# EAGLE design Main (EAGLE 7.3.0)
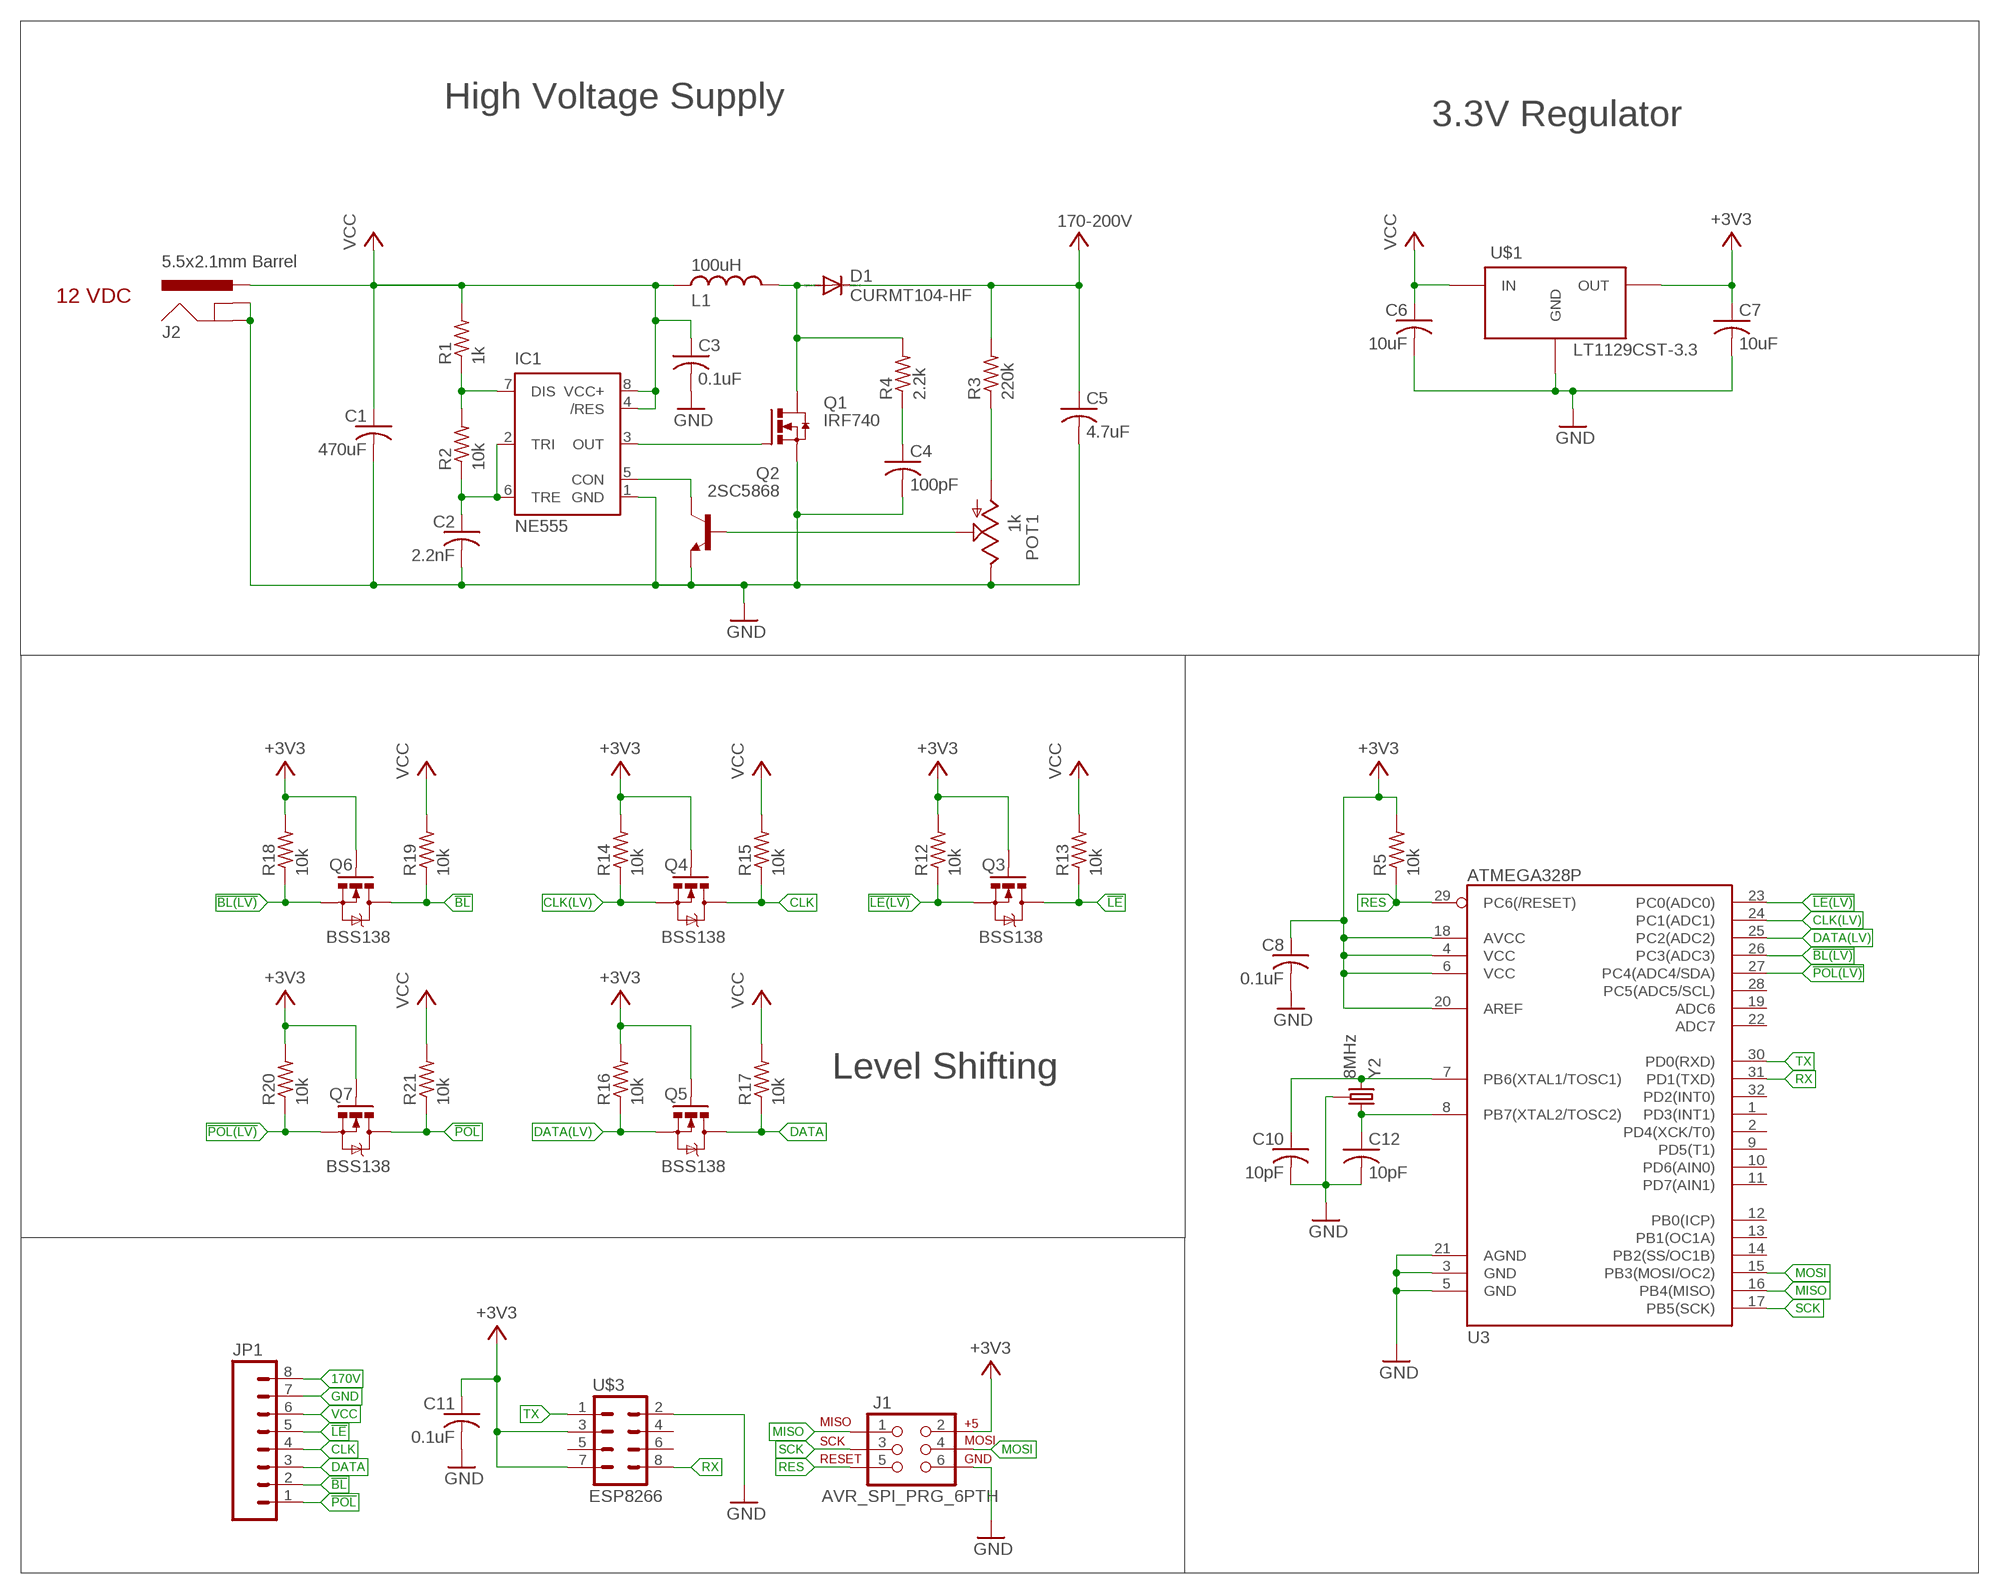
[diagram p0: schematic, sheet 1]

## Parts
C1  470uF  C-USC0603  [C0603]
C2  2.2nF  C-USC0603  [C0603]
C3  0.1uF  C-USC0603  [C0603]
C4  100pF  C-USC0603  [C0603]
C5  4.7uF  C-USC0603  [C0603]
C6  10uF  C-USC0603  [C0603]
C7  10uF  C-USC0603  [C0603]
C8  0.1uF  C-USC0603  [C0603]
C10  10pF  C-USC0603  [C0603]
C11  0.1uF  C-USC0603  [C0603]
C12  10pF  C-USC0603  [C0603]
D1  CURMT104-HF  CGRM4001-G  [SOD-123_MINI-SMA]
IC1  NE555  NE555D  [SO08]
J1  AVR_SPI_PRG_6PTH  [2X3]
J2  5.5x2.1mm Barrel  POWER_JACKSMD  [POWER_JACK_SMD]
JP1  M08  [1X08_PIN1_NO_SILK]
L1  100uH  L-USL2012C  [L2012C]
POT1  1k  TRIM_US-DIL3  [1X03]
Q1  IRF740  IRF3704S  [D2PACK]
Q2  2SC5868  BC850SMD  [SOT23-BEC]
Q3  BSS138  MOSFET-NCHANNELBSS138  [SOT23]
Q4  BSS138  MOSFET-NCHANNELBSS138  [SOT23]
Q5  BSS138  MOSFET-NCHANNELBSS138  [SOT23]
Q6  BSS138  MOSFET-NCHANNELBSS138  [SOT23]
Q7  BSS138  MOSFET-NCHANNELBSS138  [SOT23]
R1  1k  R-US_R0603  [R0603]
R2  10k  R-US_R0603  [R0603]
R3  220k  R-US_R0603  [R0603]
R4  2.2k  R-US_R0603  [R0603]
R5  10k  R-US_R0603  [R0603]
R12  10k  R-US_R0603  [R0603]
R13  10k  R-US_R0603  [R0603]
R14  10k  R-US_R0603  [R0603]
R15  10k  R-US_R0603  [R0603]
R16  10k  R-US_R0603  [R0603]
R17  10k  R-US_R0603  [R0603]
R18  10k  R-US_R0603  [R0603]
R19  10k  R-US_R0603  [R0603]
R20  10k  R-US_R0603  [R0603]
R21  10k  R-US_R0603  [R0603]
U3  ATMEGA328P  ATMEGA328_SMT  [TQFP32-08]
U$1  LT1129CST-3.3  [SOT-223]
U$3  ESP8266  M04X2  [2X4]
Y2  8MHz  CRYSTALCTS406  [CTS406]

## Nets
170V: C5.1 D1.C JP1.8 R3.2 ; supply symbol labelled 170-200V
!BL: JP1.2 Q6.3(D) R19.1
!BL(LV): Q6.2(S) R18.1 U3.26(PC3(ADC3))
!LE: JP1.5 Q3.3(D) R13.1
!LE(LV): Q3.2(S) R12.1 U3.23(PC0(ADC0))
!POL: JP1.1 Q7.3(D) R21.1
!POL(LV): Q7.2(S) R20.1 U3.27(PC4(ADC4/SDA))
+3V3: C7.1 C8.1 C11.1 J1.2 Q3.1(G) Q4.1(G) Q5.1(G) Q6.1(G) Q7.1(G) R5.2 R12.2 R14.2 R16.2 R18.2 R20.2 U3.4(VCC) U3.6(VCC) U3.18(AVCC) U3.20(AREF) U$1.VOUT(OUT) U$3.3 U$3.7
CLK: JP1.4 Q4.3(D) R15.1
CLK(LV): Q4.2(S) R14.1 U3.24(PC1(ADC1))
DATA: JP1.3 Q5.3(D) R17.1
DATA(LV): Q5.2(S) R16.1 U3.25(PC2(ADC2))
GND: C1.2 C2.2 C3.2 C4.2 C5.2 C6.2 C7.2 C8.2 C10.2 C11.2 C12.2 IC1.1(GND) J1.6 J2.GND(GNDBREAK) J2.P$4(GND) JP1.7 POT1.3(E) Q1.3(S) Q2.E U3.3(GND) U3.5(GND) U3.21(AGND) U$1.GND U$1.GND1(GND) U$3.2 Y2.2(GND) Y2.4(GND)
MISO: J1.1 U3.16(PB4(MISO))
MOSI: J1.4 U3.15(PB3(MOSI/OC2))
N$1: C2.1 IC1.2(TRI) IC1.6(TRE) R2.1
N$2: C12.1 U3.8(PB7(XTAL2/TOSC2)) Y2.1
N$3: IC1.7(DIS) R1.1 R2.2
N$4: C10.1 U3.7(PB6(XTAL1/TOSC1)) Y2.3
N$5: IC1.3(OUT) Q1.1(G)
N$6: D1.A L1.1 Q1.2(D) R4.2
N$9: C4.1 R4.1
N$12: POT1.1(A) R3.1
N$13: IC1.5(CON) Q2.C
POT1: POT1.2(S) Q2.B
RES: J1.5 R5.1 U3.29(PC6(/RESET))
RX: U3.31(PD1(TXD)) U$3.8
SCK: J1.3 U3.17(PB5(SCK))
TX: U3.30(PD0(RXD)) U$3.1
VCC: C1.1 C3.1 C6.1 IC1.4(/RES) IC1.8(VCC+) J2.VIN0(PWR) JP1.6 L1.2 R1.2 R13.2 R15.2 R17.2 R19.2 R21.2 U$1.VIN(IN)
Unconnected: U3.1(PD3(INT1)) U3.2(PD4(XCK/T0)) U3.9(PD5(T1)) U3.10(PD6(AIN0)) U3.11(PD7(AIN1)) U3.12(PB0(ICP)) U3.13(PB1(OC1A)) U3.14(PB2(SS/OC1B)) U3.19(ADC6) U3.22(ADC7) U3.28(PC5(ADC5/SCL)) U3.32(PD2(INT0)) U$3.4 U$3.5 U$3.6

## Notes on the sheet
- High Voltage Supply
- 3.3V Regulator
- 12 VDC
- Level Shifting

## Library data of the parts
C1-C8 C10-C12 = resistor:C-US: CAPACITOR, American symbol
D1 = diode:CGRM400*-G: Molded plasitc,JEDEC SOD-123/Mini SMA Source: Comchip CGRM4001-G.pdf
IC1 = SparkFun-AnalogIC:NE555: General purpose bipolar Timer
J1 = SparkFun-Connectors:AVR_SPI_PRG_6: AVR ISP 6 Pin This is the reduced ISP connector for AVR programming. Common on Arduino. This footprint will take up less PCB space and can be used with a 10-pin to 6-pin adapter such as SKU: BOB-08508 **Special note about "TEST_POINT" package. The stop mask is on the top side, so if you want your programming test points to be on the bottom of your board, make sure to place this package on the bottom side of the board. This also ensure that the orientation to program from the bottom side will be correct.
J2 = SparkFun-Connectors:POWER_JACK: Power Jack This is the standard 5.5mm barrel jack for power. The PTH is the most common, proven, reliable, footprint. The Slot footprint only works if the mill layer is transmitted to the PCB fab house so be warned. Mating wall wart : TOL-00298 (and others); PROD_ID: CONN-08106
JP1 = SparkFun-Connectors:M08: Header 8 Standard 8-pin 0.1" header. Use with straight break away headers (SKU : PRT-00116), right angle break away headers (PRT-00553), swiss pins (PRT-00743), machine pins (PRT-00117), and female headers (PRT-00115).
L1 = resistor:L-US: INDUCTOR, American symbol
POT1 = pot:TRIM_US-: POTENTIOMETER
Q1 = transistor-power:IRF3704: SMPS MOSFET HEXFET® Power MOSFET Source: http://www.irf.com/product-info/datasheets/data/irf3704.pdf
Q2 = transistor-npn:BC850*: NPN Transistor
Q3-Q7 = SparkFun-DiscreteSemi:MOSFET-NCHANNEL: Common NMOSFET Parts MFG P/N Store ID Prod ID FDD8780 TRANS-09984 SI7820DN TRANS-11055 FDS6630A IC-08089 2N7002PW TRANS-11151 FQP30N06L COM-10213 TRANS-10060 BSS123LT1G TRANS-08345 BSS138 TRANS-00830 BS170 2N7000; PROD_ID: TRANS-00830
R1-R5 R12-R21 = resistor:R-US_: RESISTOR, American symbol
U3 = SparkFun-DigitalIC:ATMEGA328_SMT: 32-Pin Atmega328 part Commonly used on Arduino compatible boards Available in QFP and QFN packages TQFP is IC-09069 QFN is non-stock; PROD_ID: IC-09069
U$1 = Alex:LT1129CST-3.3
U$3 = SparkFun-Connectors:M04X2: .1" header, two rows of four.
Y2 = crystal:CRYSTAL: CRYSTAL; OC_FARNELL: unknown; OC_NEWARK: unknown

## Board
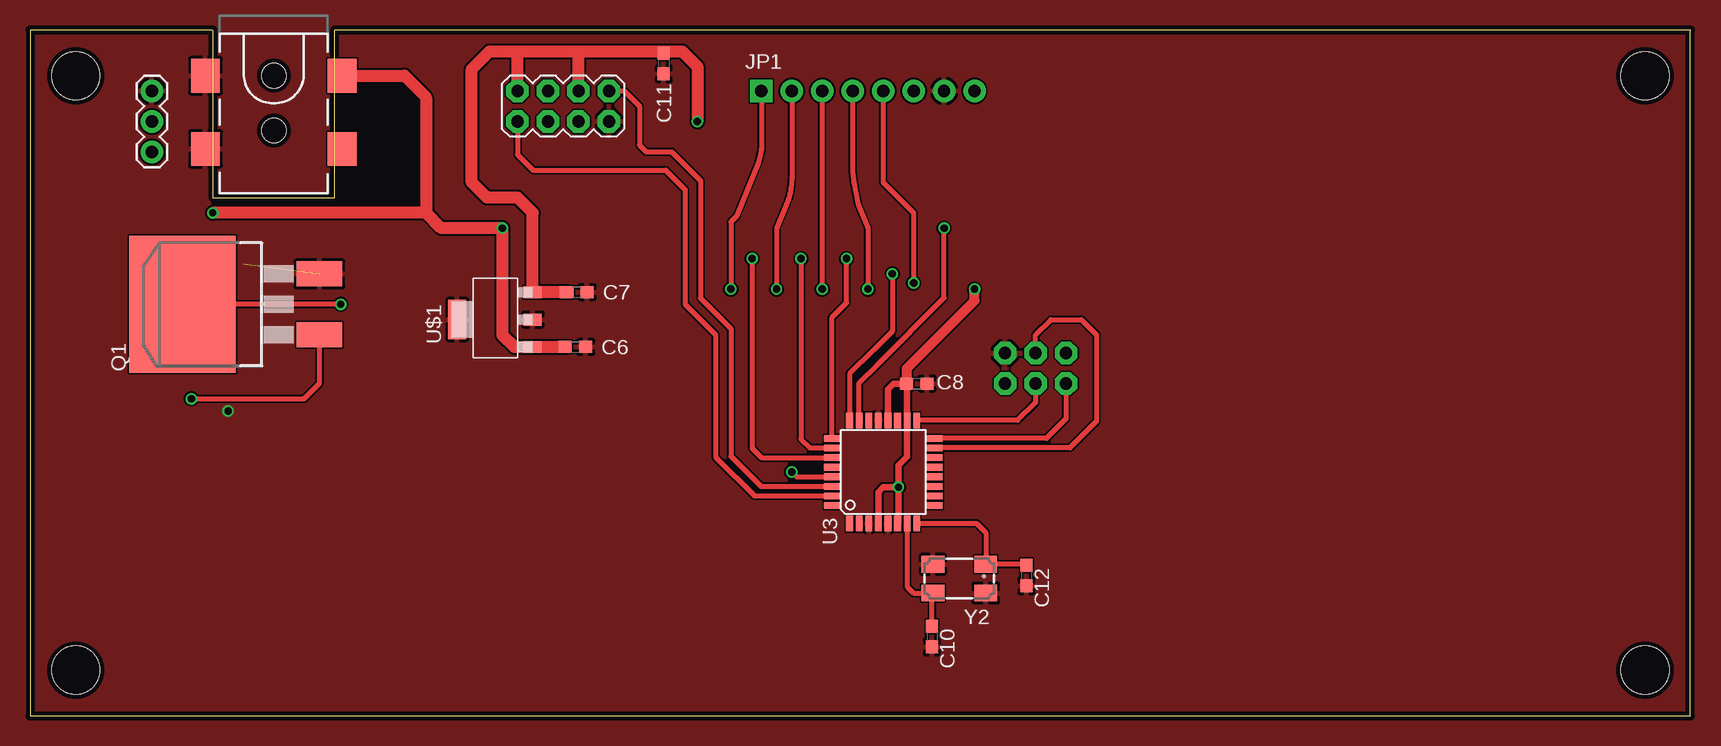
[diagram p1: board, top side]
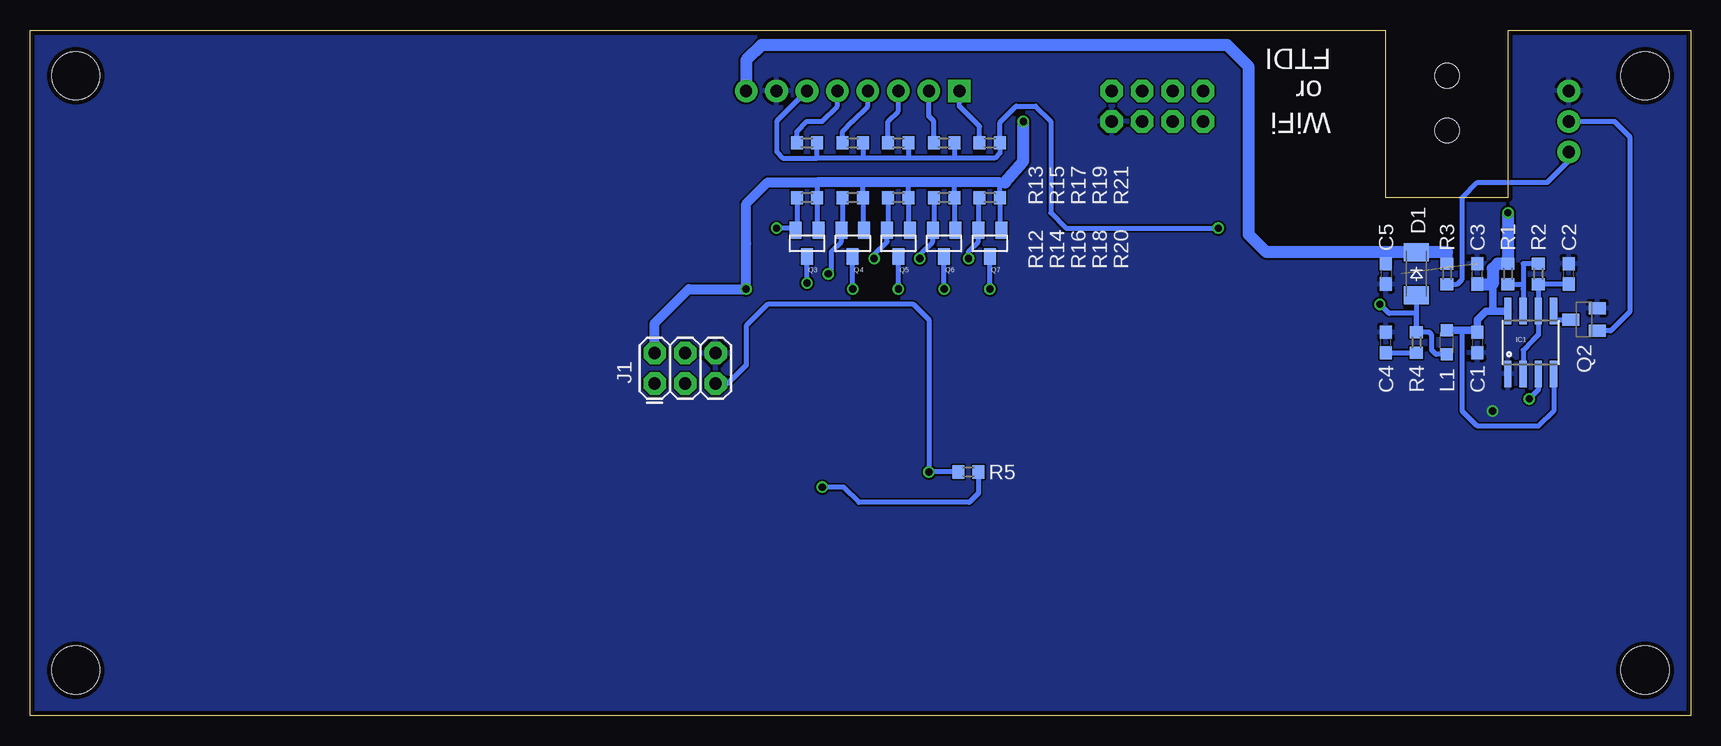
[diagram p2: board, bottom side, seen from below]

Size 138.43 x 57.15 mm. Coordinates in mm from the lower left corner, seen from the top.
Outline: 138.41,57.15 138.41,0 0,0 0,57.15 15.24,57.15 15.24,43.18 25.4,43.18 25.4,57.15 138.41,57.15
Outline: 138.41,57.15 138.43,57.15
Copper layers (1*16): Top 0.0356mm / dielectric 1.5011mm / Bottom 0.0356mm
Design rules "OSHpark": minimum track width 6mil, minimum drill 13mil, track to track 6mil, track to pad 6mil, pad to pad 6mil, via to via 6mil, smd to smd 6mil, copper to edge 15mil, drill to drill 6mil, minimum pad ring 7mil, minimum via ring 7mil, stop-mask expansion 3mil, vias tented up to drill 0mil, thermal gap 10mil
Holes 4 mm at 3.81,53.34 134.62,53.34 134.62,3.81 3.81,3.81

### Footprints (pad centres in the part's own frame; a part is rotated, then mirrored left to right if it is on the bottom)
C0603 = smd 1.1 x 1: 1 -0.85,0; 2 0.85,0
SOD-123_MINI-SMA = smd 1.5 x 2.1: A 1.8,0; C -1.8,0
SO08 = smd 0.61 x 2.21: 1 -1.905,-2.616; 2 -0.635,-2.616; 3 0.635,-2.616; 4 1.905,-2.616; 5 1.905,2.616; 6 0.635,2.616; 7 -0.635,2.616; 8 -1.905,2.616
2X3 = drill 1.016 pad 1.88 octagon: 1 0,0; 2 0,2.54; 3 2.54,0; 4 2.54,2.54; 5 5.08,0; 6 5.08,2.54
POWER_JACK_SMD = smd 2.8 x 2.4: GND 0,-5.7; P$4 6.1,-5.7; VIN0 0,5.7; VIN1 6.1,5.7 | hole 2.032: 0,0; 4.572,0
1X08_PIN1_NO_SILK = drill 1.016 pad 1.88 square: 1 0,0 | drill 1.016 pad 1.88: 2 2.54,0; 3 5.08,0; 4 7.62,0; 5 10.16,0; 6 12.7,0; 7 15.24,0; 8 17.78,0
L2012C = smd 1 x 1: 1 -1,0; 2 1,0
1X03 = drill 1.016 pad 1.88: 1 -2.54,0; 2 0,0; 3 2.54,0
D2PACK = smd 2.083 x 3.81: 1 -2.54,-8.89; 3 2.54,-8.89 | smd 11.43 x 8.89: 2 0,2.54
SOT23-BEC = smd 1 x 1.4: B -0.95,-1.1; C 0,1.1; E 0.95,-1.1
SOT23 = smd 1 x 1.4: 1 -0.95,-1.1; 2 0.95,-1.1; 3 0,1.1
R0603 = smd 1 x 1.1: 1 -0.85,0; 2 0.85,0
TQFP32-08 = smd 1.27 x 0.559: 1 -4.293,2.8; 2 -4.293,2; 3 -4.293,1.2; 4 -4.293,0.4; 5 -4.293,-0.4; 6 -4.293,-1.2; 7 -4.293,-2; 8 -4.293,-2.8; 17 4.293,-2.8; 18 4.293,-2; 19 4.293,-1.2; 20 4.293,-0.4; 21 4.293,0.4; 22 4.293,1.2; 23 4.293,2; 24 4.293,2.8 | smd 0.559 x 1.27: 9 -2.8,-4.293; 10 -2,-4.293; 11 -1.2,-4.293; 12 -0.4,-4.293; 13 0.4,-4.293; 14 1.2,-4.293; 15 2,-4.293; 16 2.8,-4.293; 25 2.8,4.293; 26 2,4.293; 27 1.2,4.293; 28 0.4,4.293; 29 -0.4,4.293; 30 -1.2,4.293; 31 -2,4.293; 32 -2.8,4.293
SOT-223 = smd 0.991 x 1.499: GND 0,-2.54; VIN -2.286,-2.54; VOUT 2.286,-2.54 | smd 3.277 x 1.499: GND1 0,3.759
2X4 = drill 1.016 pad 1.88 octagon: 1 -3.81,-1.27; 2 -3.81,1.27; 3 -1.27,-1.27; 4 -1.27,1.27; 5 1.27,-1.27; 6 1.27,1.27; 7 3.81,-1.27; 8 3.81,1.27
CTS406 = smd 1.9 x 1.4: 1 -2.2,-1.2; 2 2.2,-1.2; 3 2.2,1.2; 4 -2.2,1.2

### Placement (x,y rotation side)
C1  17.78,31.11 270 bottom
C2  10.16,36.83 90 bottom
C3  17.78,36.83 90 bottom
C4  25.4,31.11 90 bottom
C5  25.4,36.83 270 bottom
C6  45.47,30.73 0 top
C7  45.59,35.31 0 top
C8  73.91,27.69 0 top
C10  75.18,6.6 270 top
C11  52.83,54.36 270 top
C12  83.06,11.68 270 top
D1  22.86,36.83 270 bottom
IC1  13.34,31.11 0 bottom
J1  86.36,27.69 0 bottom
J2  20.32,53.34 270 top
JP1  60.96,52.07 0 top
L1  20.32,31.11 90 bottom
POT1  10.16,49.53 90 top
Q1  15.24,34.29 90 top
Q2  8.89,33.02 90 bottom
Q3  73.66,39.37 180 bottom
Q4  69.85,39.37 180 bottom
Q5  66.04,39.37 180 bottom
Q6  62.23,39.37 180 bottom
Q7  58.42,39.37 180 bottom
R1  15.24,36.83 90 bottom
R2  12.7,36.83 90 bottom
R3  20.32,36.83 90 bottom
R4  22.86,31.11 90 bottom
R5  60.2,20.32 0 bottom
R12  73.66,43.18 0 bottom
R13  73.66,47.75 0 bottom
R14  69.85,43.18 0 bottom
R15  69.85,47.75 0 bottom
R16  66.04,43.18 0 bottom
R17  66.04,47.75 0 bottom
R18  62.23,43.18 0 bottom
R19  62.23,47.75 0 bottom
R20  58.42,43.18 0 bottom
R21  58.42,47.75 0 bottom
U3  71.12,20.32 90 top
U$1  39.37,33.02 90 top
U$3  44.45,50.8 180 top
Y2  77.47,11.43 180 top

### Tracks (layer width: path | path; a pad name or v marks a point on that pad's centre or on a via)
170V
  Bottom 1.016: R3.2 20.32,38.63 D1.C 25.4,38.63 | 25.4,38.63 C5.1 | 25.4,38.63 35.36,38.63 36.83,40.1 36.83,54.08 38.63,55.88 77.47,55.88 78.74,54.61 JP1.8
!BL  (via drill 0.6)
  Top 0.406: JP1.2 63.5,44.87 arc-22 63.06,42.64 62.23,40.64 v62.23,35.56
  Bottom 0.406: v62.23,35.56 Q6.3 | R19.1 63.08,49.53 63.5,49.95 JP1.2
!BL(LV)  (via drill 0.6)
  Top 0.406: v64.26,38.1 64.26,23.06 65,22.32 U3.26
  Bottom 0.406: R18.1 63.08,40.47 Q6.2 63.18,39.52 64.26,38.44 v64.26,38.1
!LE  (via drill 0.6)
  Top 0.406: JP1.5 71.12,44.45 73.66,41.91 v73.66,36.07
  Bottom 0.406: v73.66,36.07 Q3.3 | 74.51,47.65 R13.1 74.51,48.68 73.66,49.53 72.39,49.53 71.12,50.8 JP1.5
!LE(LV)  (via drill 0.6)
  Top 0.406: U3.23 69.12,27.75 70.58,29.21 76.2,34.83 v76.2,40.64
  Bottom 0.406: R12.1 74.51,40.47 Q3.2 74.61,40.64 v76.2,40.64
!POL  (via drill 0.6)
  Top 0.406: JP1.1 60.96,47.22 60.74,46.11 58.88,41.63 58.42,41.17 v58.42,35.56
  Bottom 0.406: v58.42,35.56 Q7.3 | R21.1 59.27,49.11 59.69,49.53 60.96,50.8 JP1.1
!POL(LV)  (via drill 0.6)
  Top 0.406: v60.2,38.1 60.2,22.29 60.96,21.52 U3.27
  Bottom 0.406: R20.1 59.37,43.18 Q7.2 59.37,39.52 60.2,38.7 v60.2,38.1
+3V3  (via drill 0.6)
  Top 0.55: U3.20 71.52,27.21 71.99,27.69 C8.1 73.12,27.69 U3.18 73.12,21.59 72.39,20.86 v72.39,19.05 | U3.4 70.72,18.65 71.12,19.05 v72.39,19.05 | U3.6 72.39,16.03 v72.39,19.05
  Top 0.813: C8.1 73.06,28.92 78.74,34.6 v78.74,35.56
  Top 1.016: U$3.3 45.72,55.37 | 45.72,55.37 52.83,55.37 | 52.83,55.37 54.36,55.37 55.63,54.1 v55.63,49.53 | C7.1 U$1.VOUT 41.91,41.91 40.64,43.18 38.1,43.18 36.83,44.45 36.83,53.89 38.31,55.37 40.64,55.37 | 40.64,55.37 45.72,55.37 | U$3.7 40.64,55.37 | C11.1 52.83,55.37
  Bottom 0.406: Q3.1 72.81,40.47 R12.2 72.81,44.45 | Q4.1 69,40.47 R14.2 69,44.45 | Q5.1 65.19,40.47 R16.2 65.19,44.45 | Q6.1 61.38,40.47 R18.2 61.38,44.45 | Q7.1 57.57,40.47 R20.2 57.57,44.45 | R5.2 59.35,18.56 60.13,17.78 69.34,17.78 70.61,19.05 v72.39,19.05
  Bottom 0.813: 57.15,44.45 57.57,44.45 61.38,44.45 65.19,44.45 69,44.45 72.81,44.45 76.94,44.45 78.74,42.65 78.74,39.37 v78.74,35.56 83.52,35.56 86.36,32.72 J1.2
  Bottom 1.016: 57.15,44.45 55.63,46.23 v55.63,49.53
CLK  (via drill 0.6)
  Top 0.406: JP1.4 68.58,45.34 68.67,44.4 69.02,42.64 69.85,40.64 v69.85,35.56
  Bottom 0.406: v69.85,35.56 Q4.3 | R15.1 70.7,48.68 69.85,49.53 68.58,50.8 JP1.4
CLK(LV)  (via drill 0.6)
  Top 0.406: 68.32,24.64 U3.24 68.32,28.49 70.31,30.48 71.88,32.05 v71.88,36.83
  Bottom 0.406: R14.1 70.7,40.47 Q4.2 70.8,39.52 71.63,38.7 71.63,37.08 v71.88,36.83
DATA  (via drill 0.6)
  Top 0.406: JP1.3 v66.04,35.56
  Bottom 0.406: v66.04,35.56 Q5.3 | R17.1 66.89,49.53 66.04,50.38 JP1.3
DATA(LV)  (via drill 0.6)
  Top 0.406: v68.07,38.1 68.07,34.41 66.83,33.17 U3.25
  Bottom 0.406: R16.1 66.89,40.47 Q5.2 66.99,39.52 68.07,38.44 v68.07,38.1
GND  (via drill 0.6)  (1 unrouted)
  other vias: 16.51,25.4
  pour Bottom: -1.27,58.42 139.7,58.42 139.7,-1.27 -1.27,-1.27
  pour Top: 138.43,-2.54 140.97,-2.54 140.97,59.69 -2.54,59.69 -2.54,-2.54
MISO
  Top 0.406: J1.1 86.36,24.74 84.74,23.12 U3.16
MOSI
  Top 0.406: J1.4 83.82,31.75 85.09,33.02 87.63,33.02 88.9,31.75 88.9,24.53 86.69,22.32 U3.15
N$1
  Bottom 0.406: C2.1 R2.1 IC1.6 12.7,31.75 13.21,31.24 13.97,30.48 IC1.2
N$2
  Top 0.406: U3.8 78.88,16.03 79.67,15.24 Y2.1 82.97,12.63 C12.1
N$3
  Bottom 0.406: R2.2 13.97,37.68 13.97,35.98 | IC1.7 13.97,35.56 13.97,35.98 | R1.1 13.97,35.98
N$4
  Top 0.406: U3.7 73.12,10.78 73.67,10.23 Y2.3 75.18,10.23 C10.1
N$5  (via drill 0.6)
  Top 0.406: v13.46,26.42 22.84,26.42 24.13,27.71 Q1.1
  Bottom 0.406: IC1.3 12.7,27.18 v13.46,26.42
N$6  (via drill 0.6)
  Top 0.406: v25.91,34.29 Q1.2
  Bottom 0.406: R4.2 21.8,31.96 21.59,31.75 21.59,30.48 21.23,30.11 L1.1 | D1.A R4.2 | R4.2 22.86,33.53 25.15,33.53 v25.91,34.29
N$9
  Bottom 0.406: C4.1 R4.1
N$12
  Bottom 0.406: R3.1 19.47,35.98 19.05,36.4 19.05,43.18 17.78,44.45 11.96,44.45 10.16,46.25 POT1.1
N$13
  Bottom 0.406: IC1.5 11.43,33.02 Q2.C
POT1
  Bottom 0.406: Q2.B 6.67,32.07 5.08,33.66 5.08,48.26 6.35,49.53 POT1.2
RES  (via drill 0.6)
  Top 0.406: v63.5,20.32 63.9,19.92 U3.29
  Bottom 0.406: J1.5 80.26,27.69 78.74,29.21 78.74,32.49 76.94,34.29 64.77,34.29 63.5,33.02 v63.5,20.32 R5.1
RX
  Top 0.406: U$3.8 40.64,46.76 41.94,45.47 52.98,45.47 54.61,43.84 54.61,34.29 57.15,31.75 57.15,21.55 60.38,18.32 U3.31
SCK
  Top 0.406: J1.3 83.82,26.11 82.33,24.61 U3.17
TX
  Top 0.406: U$3.1 49.53,52.07 50.8,50.8 50.8,47.56 51.37,46.99 53.48,46.99 55.88,44.59 55.88,34.8 58.42,32.26 58.42,21.62 60.92,19.12 U3.30
VCC  (via drill 0.6)
  Top 1.016: J2.VIN0 31.22,53.34 33.02,51.54 33.02,41.91 | 33.02,41.91 34.29,40.64 v39.37,40.64 39.37,36.83 39.37,31.75 40.39,30.73 U$1.VIN C6.1 | 33.02,41.91 v15.24,41.91
  Bottom 0.406: 61.38,46.48 58,46.48 57.57,46.91 R21.2 57.57,49.46 56.23,50.8 54.61,50.8 53.34,49.53 53.34,41.91 52.07,40.64 v39.37,40.64 | 61.38,46.48 65.19,46.48 | 65.19,46.48 69,46.48 | 69,46.48 72.81,46.48 | 72.81,46.48 R13.2 | 72.81,46.48 75.69,46.48 76.2,46.99 76.2,49.53 JP1.6 | R19.2 61.38,46.48 | R17.2 65.19,46.48 | R15.2 69,46.48 | IC1.4 11.43,25.4 12.7,24.13 17.78,24.13 19.05,25.4 19.05,32.12
  Bottom 0.61: IC1.8 16.51,33.73 | 16.51,33.73 16.51,35.98 | 16.51,33.73 17.07,33.73 17.78,33.02 C1.1 17.78,32.12 19.05,32.12 L1.2
  Bottom 1.016: C3.1 16.51,35.98 16.51,37.26 16.09,37.68 R1.2 v15.24,41.91

### Text on the board
bNames: WiFi / or / FTDI